# EAGLE design Qwiic_VEML7700 (EAGLE 9.6.2)
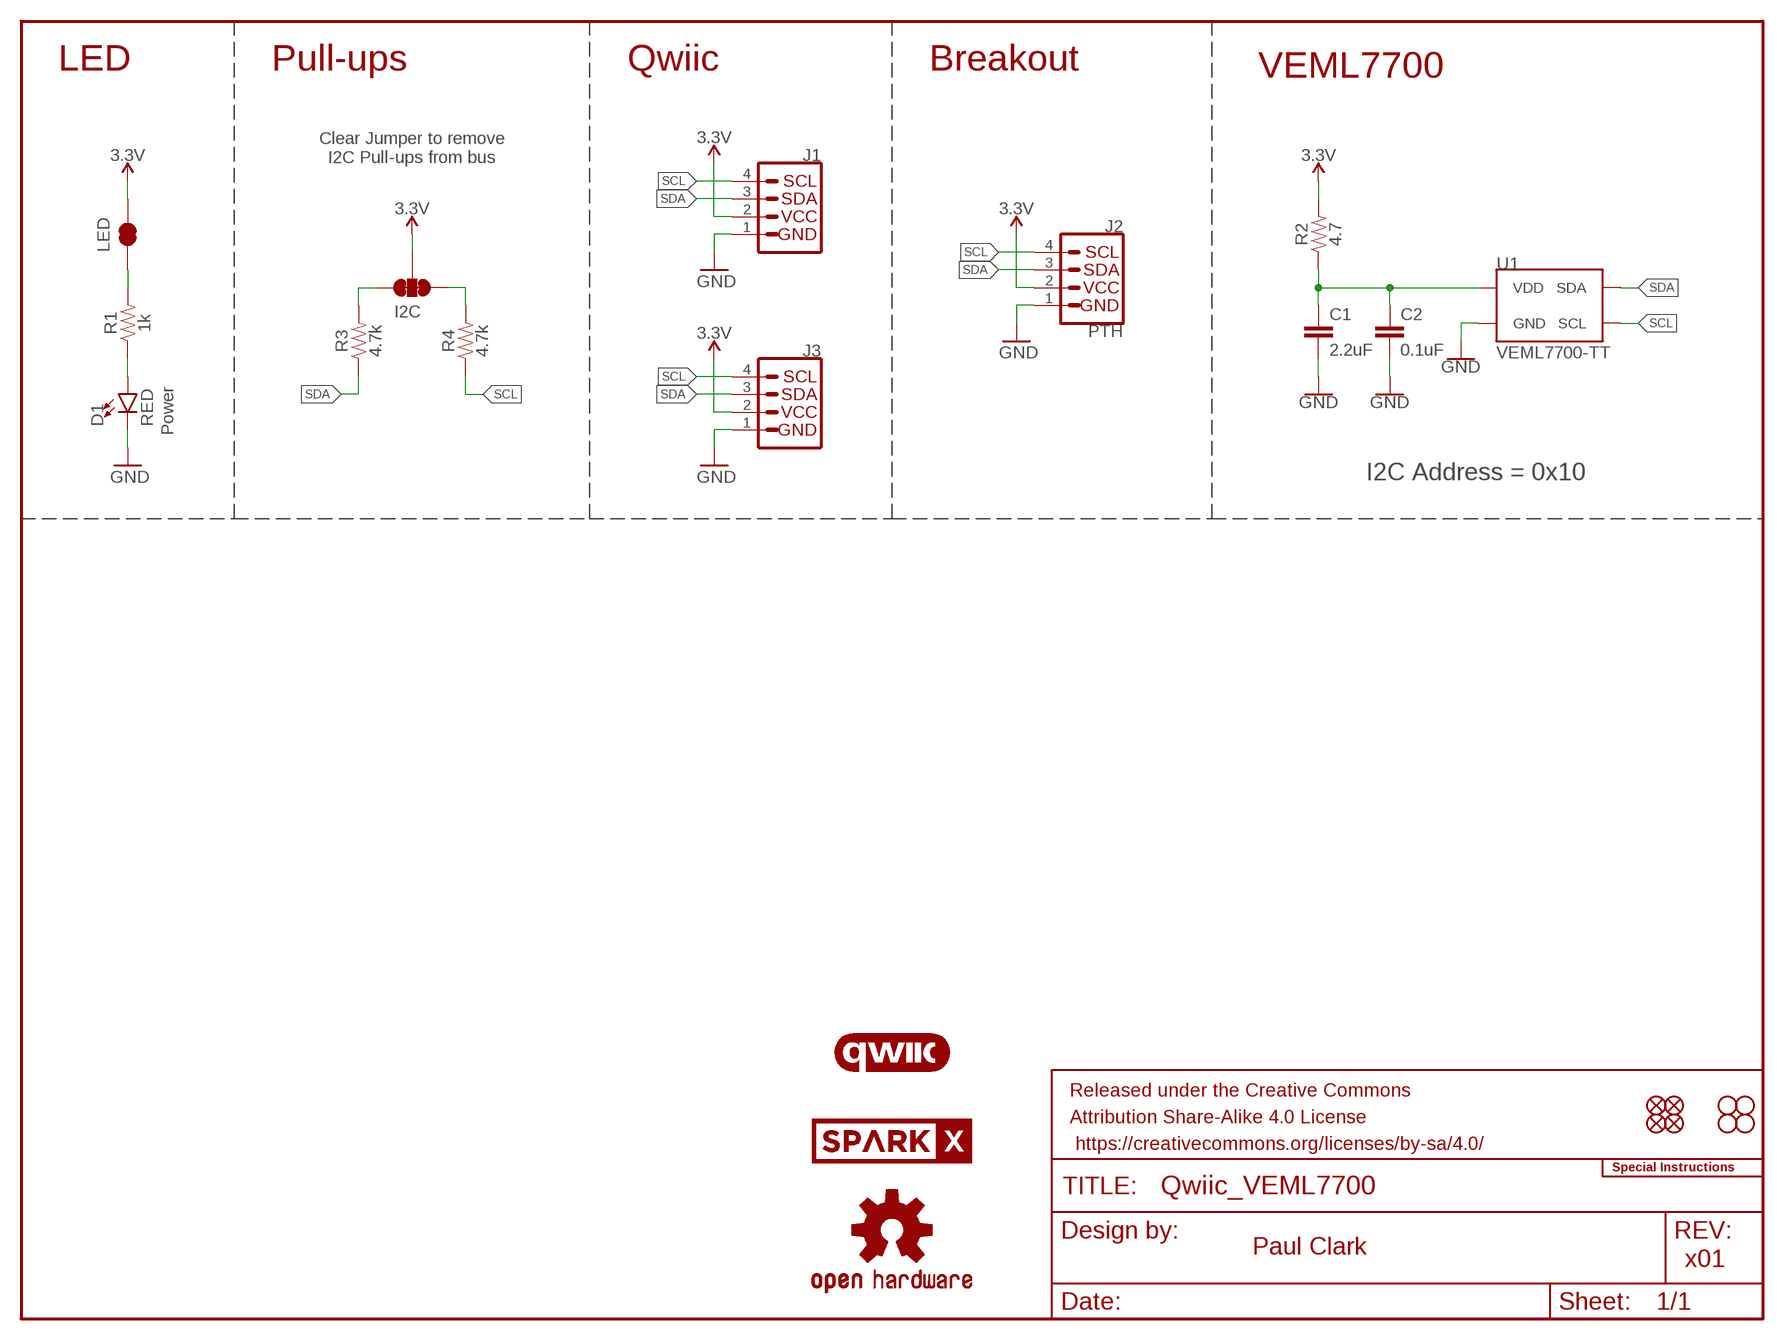
[diagram p0: schematic, sheet 1]

## Parts
C1  2.2uF  2.2UF-0402_TIGHT-10V-10%-X5R  [0402-TIGHT]
C2  0.1uF  0.1UF-0402T-6.3V-10%-X7R  [0402-TIGHT]
D1  RED  LED-RED0603  [LED-0603]
FRAME1  FRAME-LETTER  [CREATIVE_COMMONS]
I2C  JUMPER-SMT_3_2-NC_TRACE_SILK  [SMT-JUMPER_3_2-NC_TRACE_SILK]
J1  Qwiic Right Angle  I2C_STANDARDQWIIC  [JST04_1MM_RA]
J2  PTH  I2C_STANDARD_NO_SILK  [1X04_NO_SILK]
J3  Qwiic Right Angle  I2C_STANDARDQWIIC  [JST04_1MM_RA]
JP1  FIDUCIAL1X2  [FIDUCIAL-1X2]
JP2  FIDUCIAL1X2  [FIDUCIAL-1X2]
JP3  STAND-OFF  [STAND-OFF]
JP4  STAND-OFF  [STAND-OFF]
JP5  FIDUCIAL1X2  [FIDUCIAL-1X2]
JP6  FIDUCIAL1X2  [FIDUCIAL-1X2]
JP7  STAND-OFF  [STAND-OFF]
JP8  STAND-OFF  [STAND-OFF]
LED  JUMPER-SMT_2_NC_TRACE_SILK  [SMT-JUMPER_2_NC_TRACE_SILK]
LOGO1  OSHW-LOGOMINI  [OSHW-LOGO-MINI]
LOGO2  SPECIAL_INSTRUCTIONS-ORDERING  [ORDERING_INSTRUCTIONS]
LOGO3  QWIIC_LOGO_5MM  [QWIIC_5MM]
LOGO4  OSHW-LOGOMINI  [OSHW-LOGO-MINI]
R1  1k  1KOHM-0402T-1/16W-1%  [0402-TIGHT]
R2  4.7  4.7OHM-0402T-1/16W-1%  [0402-TIGHT]
R3  4.7k  4.7KOHM-0402T-1/16W-1%  [0402-TIGHT]
R4  4.7k  4.7KOHM-0402T-1/16W-1%  [0402-TIGHT]
U1  VEML7700-TT  [VEML7700_TT]
U$2  SPARKX-LOGO4  [SPARKX-MEDIUM]
U$21  SPARKX-LOGO4  [SPARKX-MEDIUM]

## Nets
3.3V: I2C.2 J1.2 J2.2 J3.2 LED.2 R2.2
GND: C1.2 C2.2 D1.C J1.1 J2.1 J3.1 U1.3(GND)
N$1: I2C.1 R4.2
N$2: I2C.3 R3.2
N$3: D1.A R1.1
N$4: LED.1 R1.2
N$5: C1.1 C2.1 R2.1 U1.2(VDD)
SCL: J1.4 J2.4 J3.4 R4.1 U1.1(SCL)
SDA: J1.3 J2.3 J3.3 R3.1 U1.4(SDA)

## Notes on the sheet
- LED | Pull-ups | Qwiic | Breakout | VEML7700
- Clear Jumper to remove
  I2C Pull-ups from bus
- Power
- I2C Address = 0x10
- Paul Clark
- x01

## Library data of the parts
C1 = SparkFun-Capacitors:2.2UF: 2.2µF ceramic capacitors A capacitor is a passive two-terminal electrical component used to store electrical energy temporarily in an electric field.; PROD_ID: CAP-14232
C2 = SparkFun-Capacitors:0.1UF: 0.1µF ceramic capacitors A capacitor is a passive two-terminal electrical component used to store electrical energy temporarily in an electric field.; PROD_ID: CAP-14993
D1 = SparkFun-LED:LED-RED: Red SMD LED Used in manufacturing of most products at SparkFun Packages: 0603 - SMD 0603 package [Product Link] <http://docs.avagotech.com/docs/AV02-0551EN> 0603 SMART - SMD 0603 SMART package ( more efficient and expensive)[Product Link] <http://www.osram-os.com/Graphics/XPic2/00077099_0.pdf> 1206 - SMD1206 package [Product Link] <https://www.sparkfun.com/datasheets/DevTools/LilyPad/Q150OVS4.pdff> SparkFun Products: Pro Mini 328 -5V <https://www.sparkfun.com/products/821> RedBoard <https://www.sparkfun.com/products/12757> IOIO-OTG <https://www.sparkfun.com/products/13613>; PROD_ID: DIO-00819
FRAME1 = SparkFun-Aesthetics:FRAME-LETTER: Schematic Frame - Letter Standard 8.5x11 US Letter frame
I2C = SparkFun-Jumpers:JUMPER-SMT_3_2-NC_TRACE: Normally closed trace jumper (2 of 2 connections) This jumper has a trace between all three pads so they are normally closed (NC). Use a razor knife to open the connection(s). For best results follow the IPC guidelines for cutting traces: Cutout at least 0.063 mm (0.005 in). Remove all loose material to clean up the cut area. Seal the cut with an approved epoxy. Reapply solder to reclose the connection(s).
J1 J3 = SparkFun-Connectors:I2C_STANDARD: SparkFun I2C Standard Pinout Header SparkFun has standardized on a pinout for all I2C based sensor breakouts. This pinout allows I2C boards to be plugged directly into the headers on Arduino Uno compatible boards, and to be daisy chained easily. Example SparkFun Products: SparkFun Atmospheric Sensor Breakout - BME280 <https://www.sparkfun.com/products/13676> SparkFun Altitude/Pressure Sensor Breakout - MPL3115A2 <https://www.sparkfun.com/products/11084> SparkFun TOF Range Finder Sensor - VL6180 <https://www.sparkfun.com/products/12785>; PROD_ID: CONN-13694
J2 = SparkFun-Connectors:I2C_STANDARD: SparkFun I2C Standard Pinout Header SparkFun has standardized on a pinout for all I2C based sensor breakouts. This pinout allows I2C boards to be plugged directly into the headers on Arduino Uno compatible boards, and to be daisy chained easily. Example SparkFun Products: SparkFun Atmospheric Sensor Breakout - BME280 <https://www.sparkfun.com/products/13676> SparkFun Altitude/Pressure Sensor Breakout - MPL3115A2 <https://www.sparkfun.com/products/11084> SparkFun TOF Range Finder Sensor - VL6180 <https://www.sparkfun.com/products/12785>
JP1 JP2 JP5 JP6 = SparkFun-Aesthetics:FIDUCIAL: Fiducial Alignment Points Point-of-reference for pick-and-place machines and other optical instruments.
JP3 JP4 JP7 JP8 = SparkFun-Hardware:STAND-OFF: Stand Off Drill holes for mechanically mounting via screws, standoffs, etc. Note: Use the keepout ring to avoid running the screw head into surrounding components. Variant Overviews STAND-OFF - Mechanical footprint for a #4 phillips button head screw. STAND-OFF-TIGHT - Mechanical footprint for a #4 phillips button head screw, Example SparkFun Products Screw - Phillips Head (1/4", 4-40, 10 pack) <https://www.sparkfun.com/products/10453> (PRT-10453) Screw - Phillips Head (1/2", 4-40, 10 pack) <https://www.sparkfun.com/products/10452> (PRT-10452) Screw - Phillips Head (3/4", 4-40, 10 pack) <https://www.sparkfun.com/products/10451> (PRT-10451) Screw - Phillips Head (1", 4-40, 10 pack) <https://www.sparkfun.com/products/10450> (PRT-10450)
LED = SparkFun-Jumpers:JUMPER-SMT_2_NC_TRACE: Normally closed trace jumper This jumper has a trace between two pads so it's normally closed (NC). Use a razor knife to open the connection. For best results follow the IPC guidelines for cutting traces: Cutout at least 0.063 mm (0.005 in). Remove all loose material to clean up the cut area. Seal the cut with an approved epoxy. Reapply solder to reclose the connection.
LOGO1 LOGO4 = SparkFun-Aesthetics:OSHW-LOGO: Open-Source Hardware (OSHW) Logo This logo indicates the piece of hardware it is found on incorporates a OSHW license and/or adheres to the definition of open source hardware found here: http://freedomdefined.org/OSHW
LOGO2 = SparkFun-Aesthetics:SPECIAL_INSTRUCTIONS: Special Ordering/Production Instructions Alert Symbol for special PCB ordering instructions or unique production process warnings. Ordering Instructions Production Instructions Types of information that should be added to box: Copper weight Soldermask color Silk color PCB thickness Number of layers PCB Standard: 1.6mm FR4 1 oz copper immersion silver plating red soldermask white silkscreen Types of information that should be added to box: Special wash requirements Depaneling instructions Humidification Glue curing Default text settings: 0.07 inch 9% ratio 50% line distance
LOGO3 = SparkFun-Aesthetics:QWIIC_LOGO: Qwiic Logos for placement on schematic and PCB. The 5.5mm silk logo is best for placing next to Qwiic connector.
R1 = SparkFun-Resistors:1KOHM: 1kΩ resistor A resistor is a passive two-terminal electrical component that implements electrical resistance as a circuit element. Resistors act to reduce current flow, and, at the same time, act to lower voltage levels within circuits. - Wikipedia; PROD_ID: RES-14342
R2 = SparkFun-Resistors:4.7OHM: 4.7Ω resistor A resistor is a passive two-terminal electrical component that implements electrical resistance as a circuit element. Resistors act to reduce current flow, and, at the same time, act to lower voltage levels within circuits. - Wikipedia; PROD_ID: RES-16312
R3 R4 = SparkFun-Resistors:4.7KOHM: 4.7kΩ resistor A resistor is a passive two-terminal electrical component that implements electrical resistance as a circuit element. Resistors act to reduce current flow, and, at the same time, act to lower voltage levels within circuits. - Wikipedia; PROD_ID: RES-15343
U1 = SparkFun-Sensors:VEML7700: Vishay VEML7700 Ambient Light Sensor VEML7700-TR is the side-view part VEML7700-TT is the top-view part; PROD_ID: IC-16311
U$2 U$21 = SparkX:SPARKX-LOGO

## Net classes
1 power: width 0.203 mm

## Board
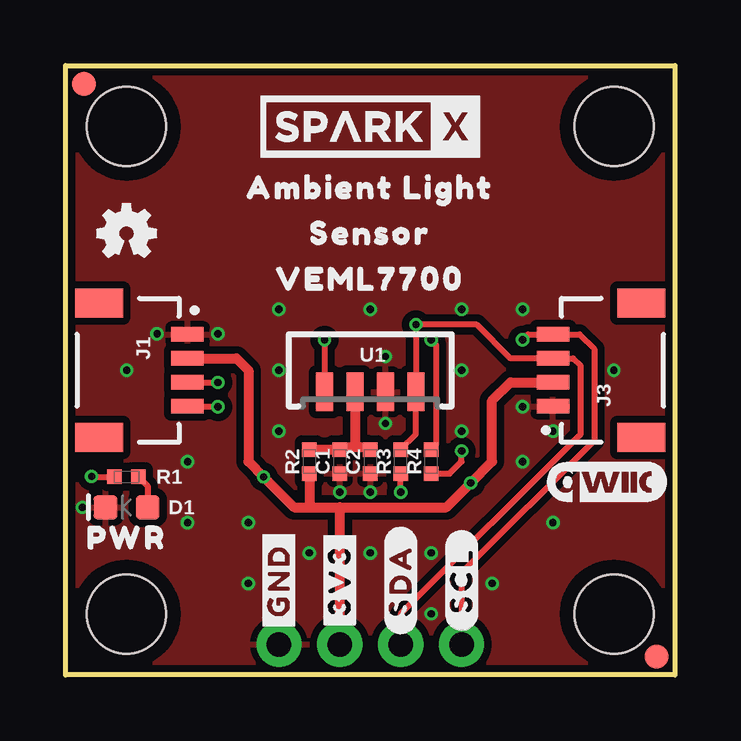
[diagram p1: board, top side]
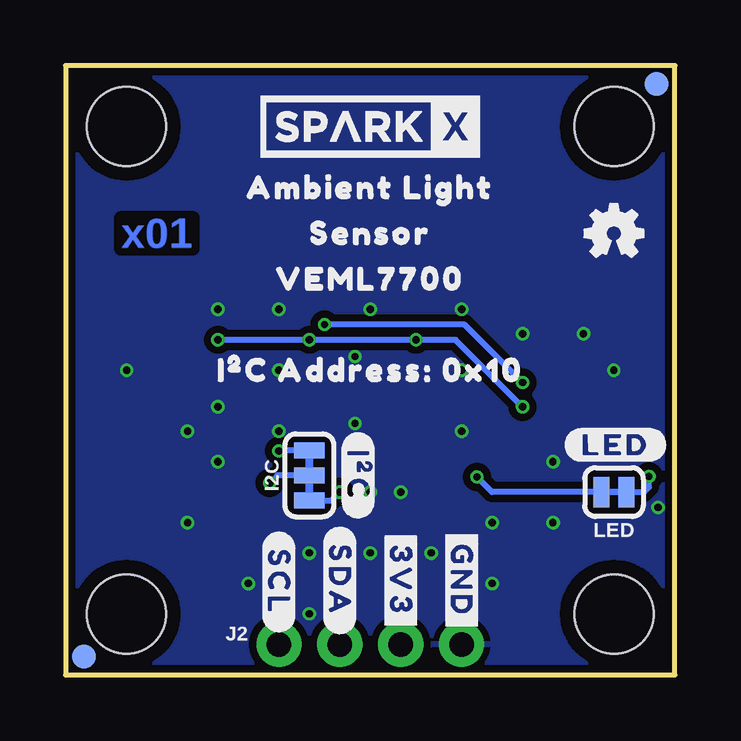
[diagram p2: board, bottom side, seen from below]

Size 25.4 x 25.4 mm. Coordinates in mm from the lower left corner, seen from the top.
Outline: 0,0 0,25.4 25.4,25.4 25.4,0 0,0
Copper layers (1*16): Top 0.035mm / dielectric 1.5mm / Bottom 0.035mm
Design rules "SparkFun-2-Layer-Minimum-JLCPCB": minimum track width 5mil, minimum drill 0.3mm, track to track 5mil, track to pad 5mil, pad to pad 5mil, via to via 5mil, smd to smd 5mil, copper to edge 7mil, drill to drill 7mil, minimum pad ring 5mil, minimum via ring 5mil, stop-mask expansion 2.5mil, vias tented up to drill 25mil, thermal gap 10mil

### Footprints (pad centres in the part's own frame; a part is rotated, then mirrored left to right if it is on the bottom)
0402-TIGHT = smd 0.6 x 0.6: 1 -0.5,0; 2 0.5,0
LED-0603 = smd 1 x 1: A -0.877,0; C 0.877,0
SMT-JUMPER_3_2-NC_TRACE_SILK = smd 0.66 x 1.27: 1 -1.041,0; 2 0,0; 3 1.041,0
JST04_1MM_RA = smd 0.6 x 1.35: 1 -1.5,0; 2 -0.5,0; 3 0.5,0; 4 1.5,0 | smd 1.2 x 2: NC1 2.8,-3.675; NC2 -2.8,-3.675
1X04_NO_SILK = drill 1.016 pad 1.88: 1 0,0; 2 2.54,0; 3 5.08,0; 4 7.62,0
FIDUCIAL-1X2 = smd 1 x 1: 1 0,0
STAND-OFF = hole 3.302: 0,0
SMT-JUMPER_2_NC_TRACE_SILK = smd 0.66 x 1.27: 1 -0.521,0; 2 0.521,0
VEML7700_TT = smd 0.7 x 1.6: 1 -1.905,-0.9; 2 -0.635,-0.9; 3 0.635,-0.9; 4 1.905,-0.9

### Placement (x,y rotation side)
C1  11.43,8.89 270 top
C2  12.7,8.89 270 top
D1  2.54,6.99 180 top
FRAME1  53.34,-8.89 0 top  (outside the outline)
I2C  15.24,8.32 270 bottom
J1  5.08,12.7 270 top
J2  8.89,1.27 180 bottom
J3  20.32,12.7 90 top
JP1  0.76,24.64 0 bottom
JP2  24.64,0.76 0 top
JP3  2.54,22.86 0 top
JP4  22.86,22.86 0 top
JP5  24.64,0.76 0 bottom
JP6  0.76,24.64 0 top
JP7  22.86,2.54 0 top
JP8  2.54,2.54 0 top
LED  2.54,7.62 180 bottom
LOGO1  2.54,18.41 0 top
LOGO2  33.02,50.8 0 top  (outside the outline)
LOGO3  22.54,8.06 0 top
LOGO4  2.54,18.41 0 bottom
R1  2.54,8.26 180 top
R2  10.16,8.89 270 top
R3  13.97,8.89 270 top
R4  15.24,8.89 270 top
U1  12.7,12.7 0 top
U$1  [#3V3#0]  11.43,3.94 90 top
U$2  12.7,22.86 0 bottom
U$3  [#3V3#0]  11.43,3.94 270 bottom
U$4  [#GND#0]  8.89,3.94 90 top
U$5  [#GND#0]  8.89,3.94 270 bottom
U$6  [#SDA#0]  13.97,3.94 90 top
U$7  [#SDA#0]  13.97,3.94 270 bottom
U$8  [#SCL#0]  16.51,3.94 90 top
U$9  [#SCL#0]  16.51,3.87 270 bottom
U$10  [PWR0]  2.54,5.71 0 top
U$11  [AMBIENT_LIGHT0]  12.7,20.32 0 top
U$12  [AMBIENT_LIGHT0]  12.7,20.32 0 bottom
U$13  [SENSOR0]  12.7,18.41 0 top
U$14  [SENSOR0]  12.7,18.41 0 bottom
U$15  [VEML77000]  12.7,16.51 0 top
U$16  [VEML77000]  12.7,16.51 0 bottom
U$17  [#I�C#0]  13.21,8.32 270 bottom
U$18  [I�C_ADDRESS#_0X100]  12.7,12.7 0 bottom
U$19  [#LED#0]  2.48,9.59 0 bottom
U$21  12.7,22.86 0 top

### Tracks (layer width: path | path; a pad name or v marks a point on that pad's centre or on a via)
3.3V  (via drill 0.3)
  Top 0.406: J1.2 7.12,13.2 7.62,12.7 7.62,8.89 v8.26,8.26 9.53,6.99 10.16,6.99 | J3.2 18.55,12.2 17.78,11.43 17.78,8.89 v16.89,8 15.88,6.99 11.43,6.99 | 10.16,6.99 11.43,6.99 | R2.2 10.16,6.99 | J2.2 11.43,6.99
  Bottom 0.254: v8.26,8.26 7.62,7.62 LED.2 | I2C.2 16.57,8.32 v16.89,8
GND  (via drill 0.3)
  other vias: 0.7,6.99 3.81,14.22 6.35,14.22 13.34,10.48 13.34,13.27 19.05,11.18 20.32,10.16 12.7,7.62 11.43,7.62 5.08,8.89 5.08,6.35 7.62,6.35 10.16,5.08 12.7,5.08 15.24,5.08 19.05,8.89 20.32,6.35 17.78,3.81 7.62,3.81 2.54,12.7 22.86,12.7 19.05,15.24 12.7,15.24 8.89,15.24 16.51,15.24 15.24,2.54 8.89,12.7 8.89,10.16 16.51,10.16 16.51,12.7
  pour Bottom (isolate 0.305): 0,0 0,25.4 25.4,25.4 25.4,0
  pour Top (isolate 0.305): 0,0 0,25.4 25.4,25.4 25.4,0
N$1  (via drill 0.3)
  Top 0.254: R4.2 16.01,8.39 16.51,8.89 v16.51,9.34
  Bottom 0.254: I2C.1 16.48,9.36 v16.51,9.34
N$2  (via drill 0.3)
  Top 0.254: v13.97,7.62 R3.2
  Bottom 0.254: I2C.3 14.31,7.28 v13.97,7.62
N$3
  Top 0.254: R1.1 3.42,7.88 D1.A
N$4  (via drill 0.3)
  Top 0.254: v1.08,8.27 1.09,8.26 R1.2
  Bottom 0.254: LED.1 1.28,7.62 1.08,7.83 v1.08,8.27
N$5
  Top 0.406: R2.1 C1.1 11.54,9.5 12.06,9.5 | C2.1 12.59,9.5 12.06,9.5 | U1.2 12.06,9.5
SCL  (via drill 0.3)
  Top 0.254: J1.4 6.33,11.2 v6.35,11.18 | v10.79,13.97 U1.1 | v19.05,13.97 19.28,14.2 J3.4 21.42,14.2 22.04,13.59 22.04,9.78 16.51,4.25 J2.4 | R4.1 15.43,9.58 15.43,13.78 v15.24,13.97
  Bottom 0.254: v6.35,11.18 9.14,13.97 v10.79,13.97 v15.24,13.97 v19.05,13.97
SDA  (via drill 0.3)
  Top 0.254: J1.3 v6.34,12.2 v6.35,12.19 | R3.1 14.61,10.03 U1.4 v14.61,14.61 17.14,14.61 18.55,13.2 J3.3 21.15,13.2 21.46,12.89 21.46,10.03 13.97,2.54 J2.3
  Bottom 0.254: v6.35,12.19 8.76,14.61 v14.61,14.61

### Text on the board
Bottom: x01
Measures: Dimensions in inches
tDocu: 1.6mm PCB / 2-Layer / 1oz Copper / HASL Finish | Paul Clark